# Altium schematic sheet PT100.SchDoc: Isolated PT100
size A4; Revision: 1; SheetNumber: 6; SheetTotal: 7; SheetSize: A4
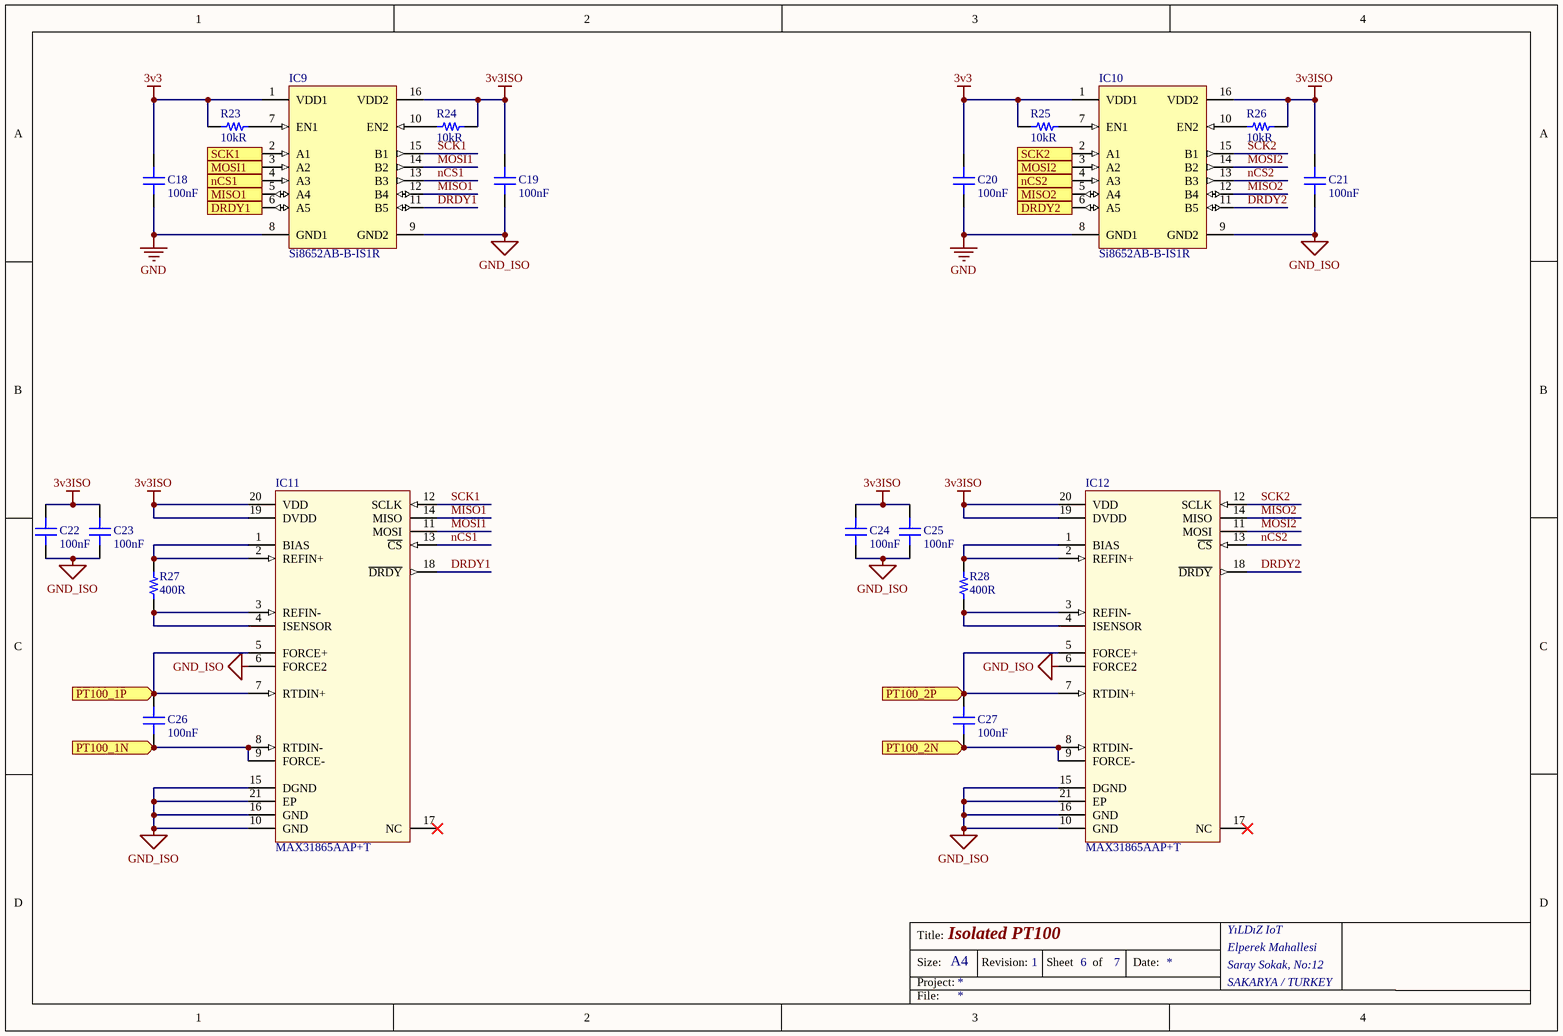
[diagram p0: PT100.SchDoc]

## Parts
C18  100nF  [CAP 0603/1608]
C19  100nF  [CAP 0603/1608]
C20  100nF  [CAP 0603/1608]
C21  100nF  [CAP 0603/1608]
C22  100nF  [CAP 0603/1608]
C23  100nF  [CAP 0603/1608]
C24  100nF  [CAP 0603/1608]
C25  100nF  [CAP 0603/1608]
C26  100nF  [CAP 0603/1608]
C27  100nF  [CAP 0603/1608]
IC9  Si8652AB-B-IS1R  [SI LABS SOIC-16 WIDE]
IC10  Si8652AB-B-IS1R  [SI LABS SOIC-16 WIDE]
IC11  MAX31865AAP+T  [MAXIM QFN-20 5x5mm]
IC12  MAX31865AAP+T  [MAXIM QFN-20 5x5mm]
R23  10kR  [RES 0603/1608]
R24  10kR  [RES 0603/1608]
R25  10kR  [RES 0603/1608]
R26  10kR  [RES 0603/1608]
R27  400R  [RES 0603/1608]
R28  400R  [RES 0603/1608]

## Ports
DRDY1 (out), DRDY2 (out), MISO1 (out), MISO2 (out), MOSI1 (in), MOSI2 (in), nCS1 (in), nCS2 (in), PT100_1N (in), PT100_1P (in), PT100_2N (in), PT100_2P (in), SCK1 (in), SCK2 (in)

## Nets
3v3: C18.2 C20.2 IC9.1(VDD1) IC10.1(VDD1) R23.1 R25.1
3v3ISO: C19.2 C21.2 C22.2 C23.2 C24.2 C25.2 IC9.16(VDD2) IC10.16(VDD2) IC11.19(DVDD) IC11.20(VDD) IC12.19(DVDD) IC12.20(VDD) R24.2 R26.2
GND: C18.1 C20.1 IC9.8(GND1) IC10.8(GND1)
GND_ISO: C19.1 C21.1 C22.1 C23.1 C24.1 C25.1 IC9.9(GND2) IC10.9(GND2) IC11.6(FORCE2) IC11.10(GND) IC11.15(DGND) IC11.16(GND) IC11.21(EP) IC12.6(FORCE2) IC12.10(GND) IC12.15(DGND) IC12.16(GND) IC12.21(EP)
DRDY1: IC9.6(A5) ; port DRDY1
DRDY1: IC9.11(B5) IC11.18(~{DRDY})  [a separate net that carries the same name]
DRDY2: IC10.6(A5) ; port DRDY2
DRDY2: IC10.11(B5) IC12.18(~{DRDY})  [a separate net that carries the same name]
MISO1: IC9.5(A4) ; port MISO1
MISO1: IC9.12(B4) IC11.14(MISO)  [a separate net that carries the same name]
MISO2: IC10.5(A4) ; port MISO2
MISO2: IC10.12(B4) IC12.14(MISO)  [a separate net that carries the same name]
MOSI1: IC9.3(A2) ; port MOSI1
MOSI1: IC9.14(B2) IC11.11(MOSI)  [a separate net that carries the same name]
MOSI2: IC10.3(A2) ; port MOSI2
MOSI2: IC10.14(B2) IC12.11(MOSI)  [a separate net that carries the same name]
nCS1: IC9.4(A3) ; port nCS1
nCS1: IC9.13(B3) IC11.13(~{CS})  [a separate net that carries the same name]
nCS2: IC10.4(A3) ; port nCS2
nCS2: IC10.13(B3) IC12.13(~{CS})  [a separate net that carries the same name]
PT100_1N: C26.1 IC11.8(RTDIN-) IC11.9(FORCE-) ; port PT100_1N
PT100_1P: C26.2 IC11.5(FORCE+) IC11.7(RTDIN+) ; port PT100_1P
PT100_2N: C27.1 IC12.8(RTDIN-) IC12.9(FORCE-) ; port PT100_2N
PT100_2P: C27.2 IC12.5(FORCE+) IC12.7(RTDIN+) ; port PT100_2P
SCK1: IC9.2(A1) ; port SCK1
SCK1: IC9.15(B1) IC11.12(SCLK)  [a separate net that carries the same name]
SCK2: IC10.2(A1) ; port SCK2
SCK2: IC10.15(B1) IC12.12(SCLK)  [a separate net that carries the same name]
NetIC9_7: IC9.7(EN1) R23.2
NetIC9_10: IC9.10(EN2) R24.1
NetIC10_7: IC10.7(EN1) R25.2
NetIC10_10: IC10.10(EN2) R26.1
NetIC11_1: IC11.1(BIAS) IC11.2(REFIN+) R27.2
NetIC11_3: IC11.3(REFIN-) IC11.4(ISENSOR) R27.1
NetIC12_1: IC12.1(BIAS) IC12.2(REFIN+) R28.2
NetIC12_3: IC12.3(REFIN-) IC12.4(ISENSOR) R28.1

Not connected (* = marked no-connect by the designer): IC11 17(NC)*; IC12 17(NC)*

## Notes on the sheet
- Title:
- Size:
- Project:
- Revision:
- Sheet
- of
- Date:
- YıLDıZ IoT
- Elperek Mahallesi
- Saray Sokak, No:12
- SAKARYA / TURKEY
- File:

## Library data of the parts
C18-C27 = Capacitor - Ceramic: Ceramic, SMT Capacitor; Manufacturer: Samsung; Manufacturer Part Number: CL10B104JB8NNNC; Tolerance: 5%; Voltage Rating: 50V; Dielectric: X7R; Supplier 1: Digi-Key; Supplier Part Number 1: 1276-1033-1-ND; Stock 1: 223594; Pricing 1: 1 = 0,10000, 10 = 0,05300, 100 = 0,02350, 500 = 0,01680, 1000 = 0,01320 (USD); RoHS: Yes; Mount: Surface Mount; Case/Package: 0603; Case Code (Metric): 1608; Case Code (Imperial): 0603; Material: Ceramic; Contact Plating: Tin; Min Operating Temperature: -55°C; Max Operating Temperature: 125°C; Packaging: Tape and Reel; Package Quantity: 1; Capacitance: 100nF; Voltage: 50V; Length: 1.6mm; Height: 0.8mm; Width: 0.031inch; Thickness: 0.035inch; Depth: 0.8mm; Radiation Hardening: No; ComponentLink1URL: https://media.digikey.com/pdf/Data%20Sheets/Samsung%20PDFs/CL_Series_MLCC_ds.pdf?src-supplier=Digi-Key; ComponentLink1Description: https://media.digikey.com/pdf/Data%20Sheets/Samsung%20PDFs/CL_Series_MLCC_ds.pdf?src-supplier=Digi-Key; ComponentLink2URL: https://www.verical.com/server-webapp/html/getDatasheet?partID=359321&src-supplier=Verical; ComponentLink2Description: https://www.verical.com/server-webapp/html/getDatasheet?partID=359321&src-supplier=Verical; ComponentLink3URL: http://www1.futureelectronics.com/doc/SAMSUNG/CL10B104JB8NNNC.pdf?src-supplier=Future+Electronics; ComponentLink3Description: http://www1.futureelectronics.com/doc/SAMSUNG/CL10B104JB8NNNC.pdf?src-supplier=Future+Electronics; ComponentLink4URL: https://produktinfo.conrad.com/datenblaetter/450000-474999/456613-da-01-en-VS_KONDENSATOR_0603.pdf?src-supplier=Conrad; ComponentLink4Description: https://produktinfo.conrad.com/datenblaetter/450000-474999/456613-da-01-en-VS_KONDENSATOR_0603.pdf?src-supplier=Conrad
IC9 IC10 = SI LABS SI8652: Manufacturer: Silicon Labs; Propagation Delay: 35ns; Min Supply Voltage: 2.7V; Max Supply Voltage: 5.5V; Max Power Dissipation: 415mW; Number of Channels: 5; Data Rate: 1Mbps; Isolated Power: No; Pulse Width Distortion (PWD): 25ns; Operating Supply Current: 4.1mA; Channel Type: Unidirectional; Supplier 1: Digi-Key; Supplier Part Number 1: 336-5216-1-ND; Manufacturer Part Number: Si8652AB-B-IS1R; Stock 1: 2236; Pricing 1: 1 = 2,10000, 25 = 2,02120, 100 = 1,94360 (USD); RoHS: Yes; Case/Package: SOIC; Number of Pins: 16; Min Operating Temperature: -40°C; Max Operating Temperature: 125°C; Type: General Purpose; Packaging: Tape and Reel; Package Quantity: 2500; ComponentLink1URL: https://datasheet.ciiva.com/29891/si86xx-29891881.pdf?src-supplier=Avnet; ComponentLink1Description: https://datasheet.ciiva.com/29891/si86xx-29891881.pdf?src-supplier=Avnet; ComponentLink2URL: https://datasheet.ciiva.com/29659/si86xx-29659290.pdf?src-supplier=Digi-Key; ComponentLink2Description: https://datasheet.ciiva.com/29659/si86xx-29659290.pdf?src-supplier=Digi-Key
IC11 IC12 = Maxim MAX31865: RTD-to-Digital Converter; Manufacturer: Maxim; Description: IC RTD TO DIGITAL CONVERT 20SSOP; Output Type: SPI; ComponentLink1URL: https://datasheet.ciiva.com/14320/max31865-14320743.pdf?src-supplier=Avnet; ComponentLink1Description: https://datasheet.ciiva.com/14320/max31865-14320743.pdf?src-supplier=Avnet; ComponentLink2URL: https://datasheet.ciiva.com/25893/max31865-25893916.pdf?src-supplier=Avnet+Europe; ComponentLink2Description: https://datasheet.ciiva.com/25893/max31865-25893916.pdf?src-supplier=Avnet+Europe; ComponentLink3URL: https://datasheet.ciiva.com/14083/max31865-14083679.pdf?src-supplier=Digi-Key; ComponentLink3Description: https://datasheet.ciiva.com/14083/max31865-14083679.pdf?src-supplier=Digi-Key; Supplier 1: Digi-Key; Supplier Part Number 1: MAX31865AAP+TCT-ND; Manufacturer Part Number: MAX31865AAP+T; Stock 1: 3767; Pricing 1: 1 = 5,14000, 10 = 4,64400, 25 = 4,42800, 100 = 3,67200, 250 = 3,51000 (USD); RoHS: Yes; Mount: Surface Mount; Case/Package: SSOP; Min Operating Temperature: -40°C; Max Operating Temperature: 125°C; Packaging: Tape and Reel; ComponentLink4URL: https://media.digikey.com/pdf/Data%20Sheets/Maxim%20PDFs/PartNumberBreakdown_ds.pdf?src-supplier=Digi-Key; ComponentLink4Description: https://media.digikey.com/pdf/Data%20Sheets/Maxim%20PDFs/PartNumberBreakdown_ds.pdf?src-supplier=Digi-Key; ComponentLink5URL: http://www.farnell.com/datasheets/2345101.pdf?src-supplier=Farnell; ComponentLink5Description: http://www.farnell.com/datasheets/2345101.pdf?src-supplier=Farnell; ComponentLink6URL: http://www.mouser.com/ds/2/256/MAX31865-775735.pdf?src-supplier=Mouser; ComponentLink6Description: http://www.mouser.com/ds/2/256/MAX31865-775735.pdf?src-supplier=Mouser; ComponentLink7URL: https://datasheets.maximintegrated.com/en/ds/MAX31865.pdf?src-supplier=Digi-Key; ComponentLink7Description: https://datasheets.maximintegrated.com/en/ds/MAX31865.pdf?src-supplier=Digi-Key
R23-R26 = Resistor_Chip: Ceramic, SMT Capacitor; Manufacturer: Stackpole Electronics; Manufacturer Part Number: RNCP0603FTD10K0; Tolerance: 1%; Max Power Dissipation: 125mW; Temperature Coefficient: 100ppm/°C; Supplier 1: Digi-Key; Supplier Part Number 1: RNCP0603FTD10K0CT-ND; Stock 1: 183083; Pricing 1: 1 = 0,10000, 10 = 0,06700, 100 = 0,02730, 1000 = 0,01224, 2500 = 0,01063 (USD); RoHS: Yes; Mount: Surface Mount; Case/Package: 0603; Case Code (Metric): 1608; Case Code (Imperial): 0603; Contact Plating: Matte,Tin; Min Operating Temperature: -55°C; Max Operating Temperature: 155°C; Packaging: Tape and Reel; Resistance: 10kR; Composition: Thin Film; Number of Terminations: 2; Features: Anti-Sulfur,Moisture Resistant; Length: 0.059inch; Height: 0.02inch; Width: 0.031inch; Radiation Hardening: No; Lead Free: Lead Free
R27 R28 = Resistor_Chip: Ceramic, SMT Capacitor; Manufacturer: Vishay Dale Thin Film; Manufacturer Part Number: PAT0603E4000BST1; Power Rating: 150mW; Tolerance: 0.1%; Voltage Rating: 75V; Temperature Coefficient: 25ppm/°C; Supplier 1: Digi-Key; Supplier Part Number 1: PAT400ACT-ND; Stock 1: 20512; Pricing 1: 1 = 0,92000, 10 = 0,79900, 100 = 0,55660 (USD); RoHS: Yes; Case/Package: 0603; Case Code (Imperial): 0603; Case Code (Metric): 1608; Min Operating Temperature: -55°C; Max Operating Temperature: 155°C; Features: Moisture Resistant,Automotive AEC-Q200,Anti-Sulfur; Resistance: 400R; Packaging: Tape and Reel; Package Quantity: 1; Max Power Dissipation: 150mW; Termination: SMD/SMT; Composition: Thin Film; Number of Terminations: 2; Military Standard: Not; Length: 0.064inch; Height: 0.018inch; Width: 0.762mm; Depth: 0.81mm; ComponentLink1URL: https://datasheet.ciiva.com/2529/pat-2529079.pdf?src-supplier=Digi-Key; ComponentLink1Description: https://datasheet.ciiva.com/2529/pat-2529079.pdf?src-supplier=Digi-Key; ComponentLink2URL: https://datasheet.ciiva.com/2529/pat-2529080.pdf?src-supplier=Digi-Key; ComponentLink2Description: https://datasheet.ciiva.com/2529/pat-2529080.pdf?src-supplier=Digi-Key; ComponentLink3URL: https://datasheet.ciiva.com/2529/pat-2529081.pdf?src-supplier=Digi-Key; ComponentLink3Description: https://datasheet.ciiva.com/2529/pat-2529081.pdf?src-supplier=Digi-Key